# EasyEDA Pro project ProPrj_stm32星闪-2025-5_2025-05-30.epro

# Schematic Schematic1_1
Board Name: 板子B; Create Date: 2025-05-24; Page Name: P2; Project Name: stm32星闪-2025-5; Schematic Name: Schematic1_1; Update Date: 2025-05-24; Company: 嘉立创EDA; Page Size: A4; Version: V1.0
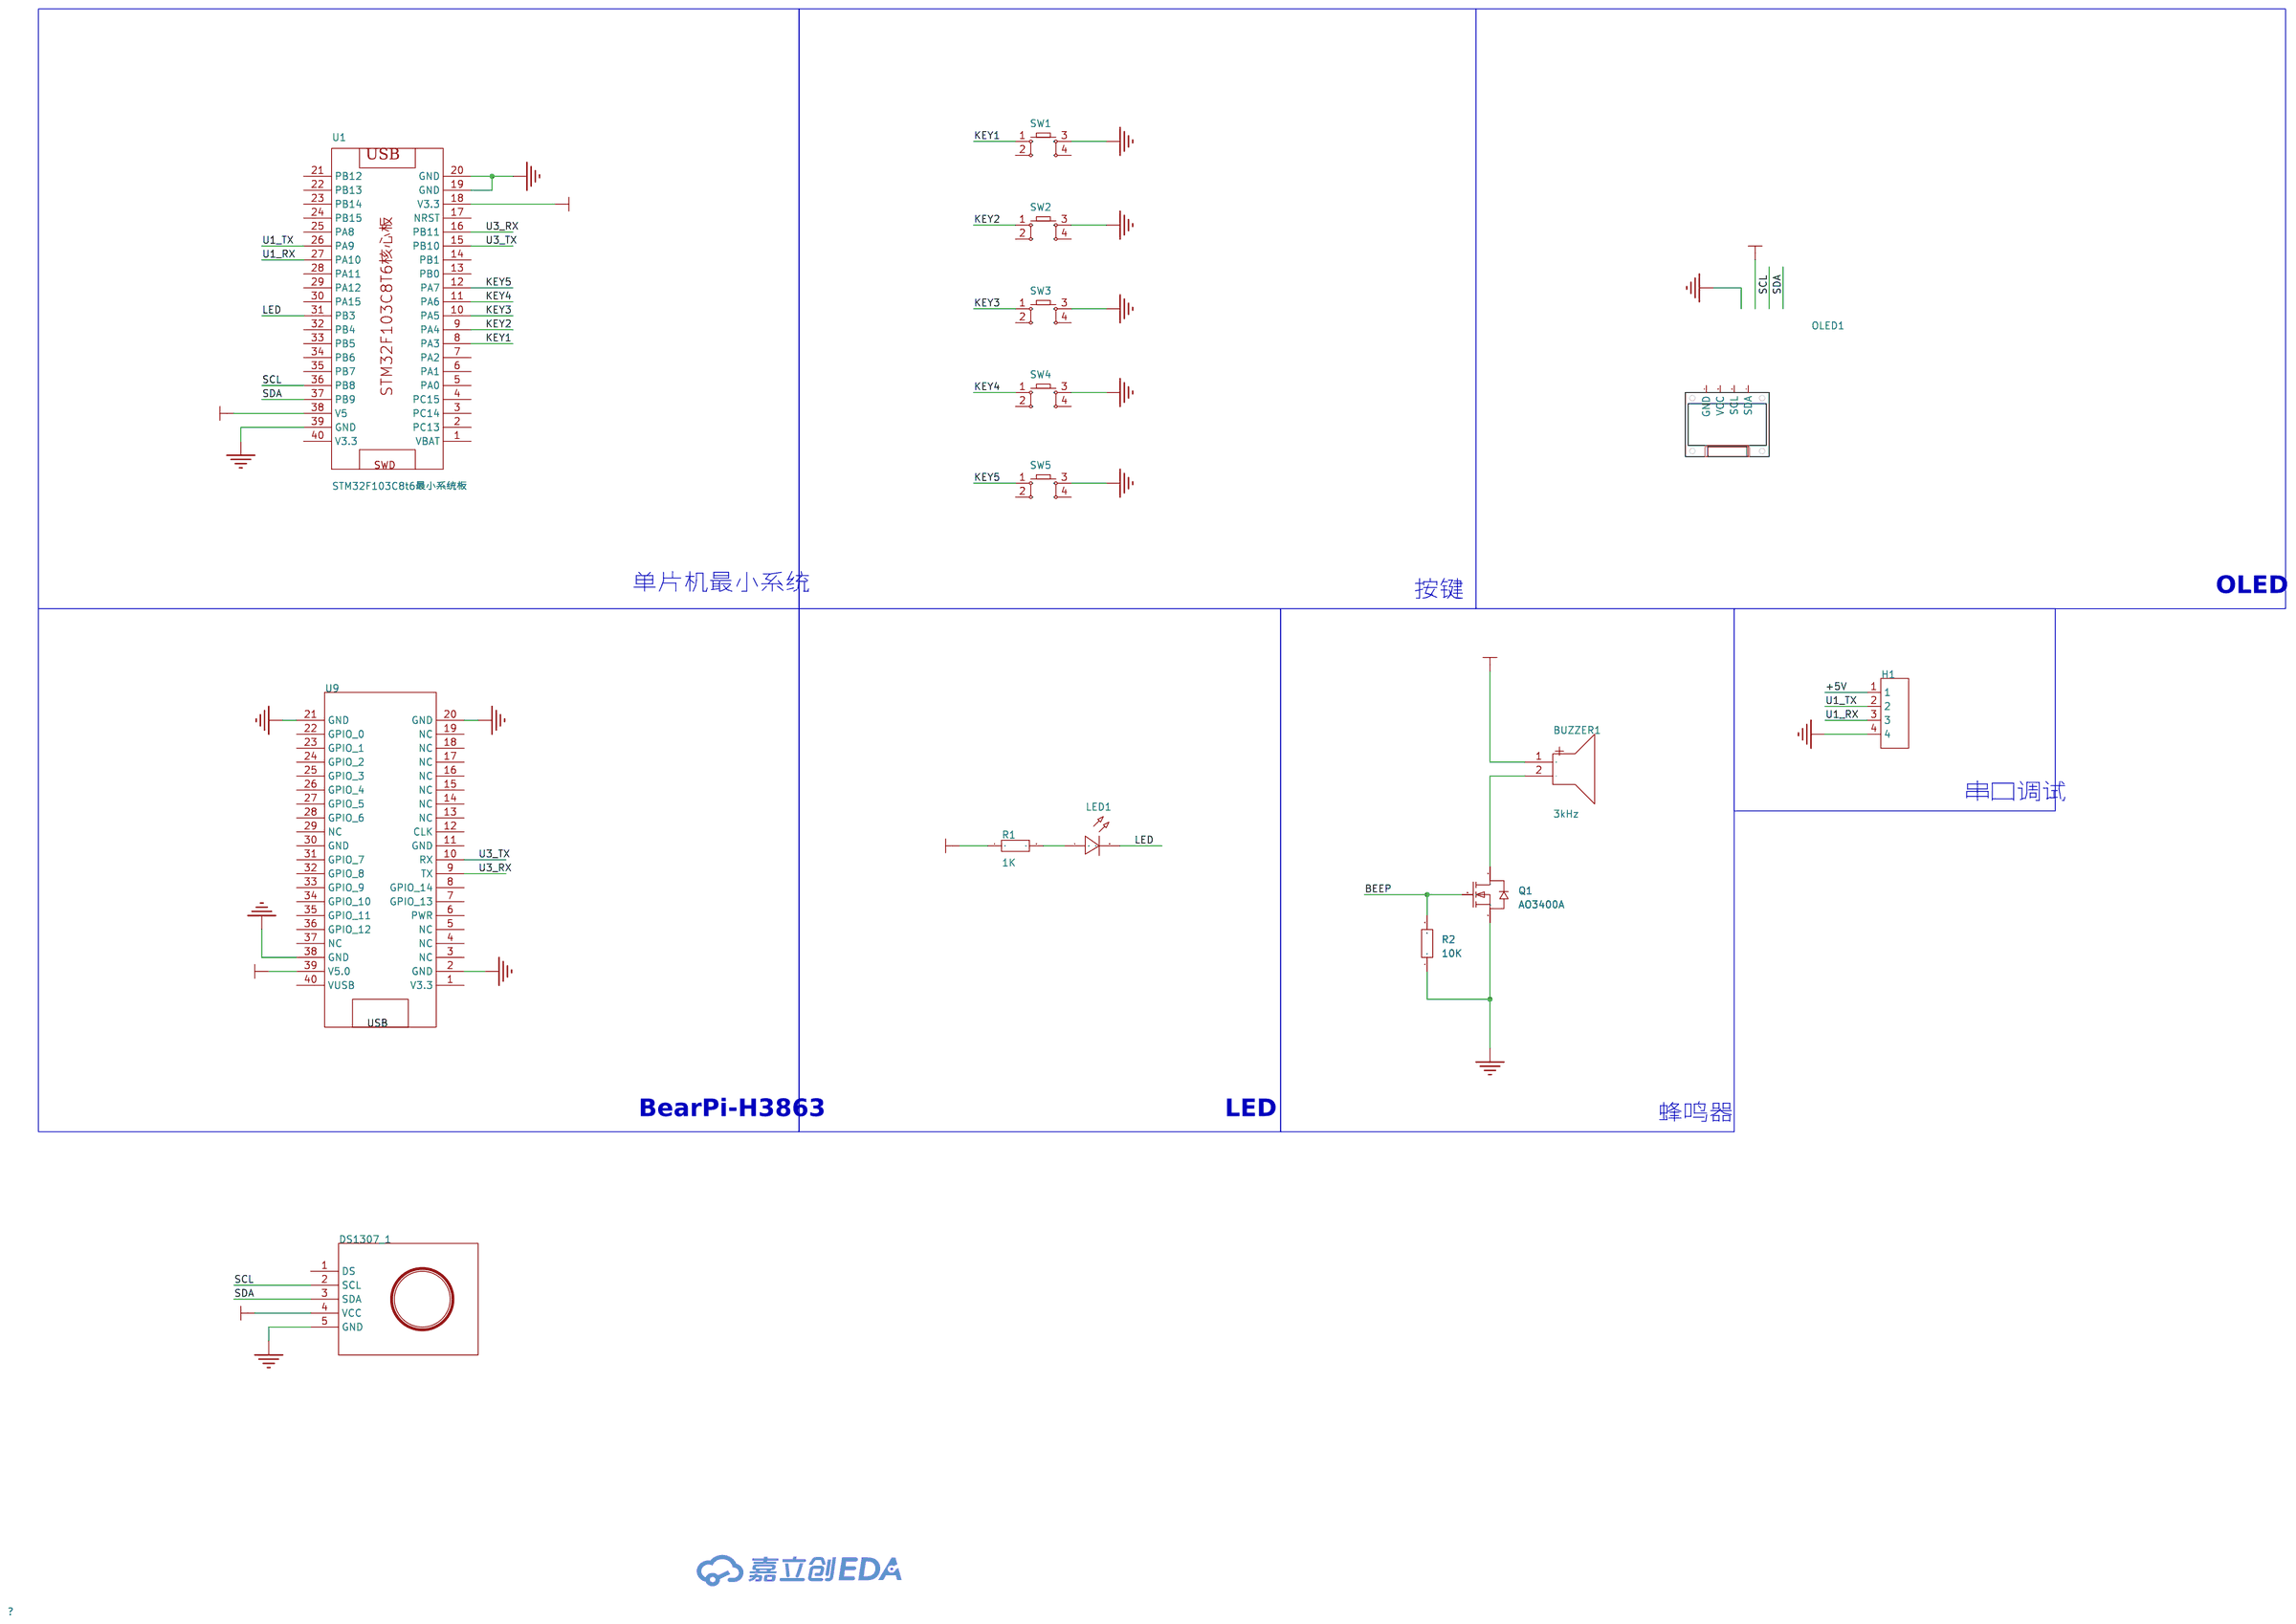
[diagram p0: schematic sheet]

## Parts
BUZZER1  3kHz  [BUZ-TH_BD9.0-P5.00-D0.6-FD]
DS1307_1  -  [DS1307时钟模块]
H1  -  [HDR-TH_4P-P2.54-V-M]
LED1  -  [LED_TH-3mm]
OLED1  -  [0.96OLED_4P]
Q1  AO3400A  [SOT-23-3_L2.9-W1.3-P1.90-LS2.4-BR]
R1  1K  [R0603]
R2  10K  [R0603]
SW1  -  [SW-TH_4P-L6.0-W6.0-P4.50-LS6.5]
SW2  -  [SW-TH_4P-L6.0-W6.0-P4.50-LS6.5]
SW3  -  [SW-TH_4P-L6.0-W6.0-P4.50-LS6.5]
SW4  -  [SW-TH_4P-L6.0-W6.0-P4.50-LS6.5]
SW5  -  [SW-TH_4P-L6.0-W6.0-P4.50-LS6.5]
U1  STM32F103C8t6最小系统板  [STM32F103C8T6核心板]
U9  -  [H3863]

## Library data of the parts
BUZZER1 = HNB09A03: 驱动方式:有源(内含驱动线路);构造类型:电磁式;频率:3kHz;声压(SPL):85dB;; LCSC Part Name: 电磁式有源一体蜂鸣器HNB09A03; Supplier Part: C96102; Manufacturer: 华能; Supplier Footprint: 插件,D=9mm; JLCPCB Part Class: 扩展库; Datasheet: https://atta.szlcsc.com/upload/public/pdf/source/20241128/61C4C8C3938BB25F7C38FBE94CCE8DCF.pdf; Supplier: LCSC; Driver Circuitry: 有源(内含驱动线路); Technology: 电磁式; Voltage - Supply: 1.5V~4.5V; Current Consumption: 30mA; Sound Pressure Level(SPL): 85dB; Diameter(φD): 9mm; Height: 5.5mm; Operating Temperature: -20℃~+70℃
DS1307_1 = DS1307_时钟模块_电池朝上: DS1307时钟模块.集成了个ATM_TC086,32KB的EEPROM
H1 = HDR-M_2.54_1x4P: Supplier Part: C492403; Supplier Footprint: 插件
LED1 = LED_TH-R_3mm: Supplier Footprint: 插件
OLED1 = 0.96OLED模块_4P: Supplier Footprint: 插件
Q1 = AO3400A_C347475: 类型:1个N沟道;漏源电压(Vdss):30V;连续漏极电流(Id):5.8A;导通电阻(RDS(on)@Vgs,Id):28mΩ@10V,5.8A;功率(Pd):1.4W;阈值电压(Vgs(th)@Id):1.4V@250uA;; LCSC Part Name: 1个N沟道 耐压:30V 电流:5.8A; Supplier Part: C347475; Manufacturer: UMW(友台半导体); Supplier Footprint: SOT-23; JLCPCB Part Class: 扩展库; Datasheet: https://atta.szlcsc.com/upload/public/pdf/source/20231109/50AB4FB4D66E55864F9B8D027B723C9A.pdf; Supplier: LCSC; Type: 1个N沟道; Drain Source Voltage (Vdss): 30V; Continuous Drain Current (Id): 5.8A; Drain Source On Resistance (RDS(on)@Vgs,Id): 28mΩ@10V,5.8A; Power Dissipation (Pd): 1.4W; Gate Threshold Voltage (Vgs(th)@Id): 1.4V@250uA; Total Gate Charge (Qg@Vgs): 12nC@10V; Input Capacitance (Ciss@Vds): 1.05nF@24V; Reverse Transfer Capacitance (Crss@Vds): 77pF@15V; Operating Temperature: -55℃~+150℃
R1 R2 = Res_0603: Supplier Footprint: 0603
SW1-SW5 = Key_TH_6x6x6: 触点电流:50mA;额定电压(DC):12V;绝缘电阻:100MΩ;电路结构:单刀单掷;安装方式:直插;按钮形状:圆形按钮;按钮/盖帽颜色:黑色;作用力:260gf@±30gf;工作温度:-25℃~+70℃;引脚样式:PC引脚;开关长度:6mm;开关宽度:6mm;开关高度:6mm;带支架:否;; Supplier Part: C2837516; Supplier Footprint: 插件
U1 = STM32F103C8T6最小系统板: tags: STM32; Supplier Part: C8734; Manufacturer: 无; Manufacturer Part: STM32F103C8T6最小系统模块; image: http://image.lceda.cn/szlcsc/C8734.jpg; JLCPCB Part Class: Basic Part
U9 = H3863: 小熊派H3863

## Nets
3V3: DS1307_1.4(VCC) R1.1 U1.18(V3.3)
+5V: BUZZER1.1(+) H1.1 U1.38(V5) U9.39(V5.0)
GND: DS1307_1.5(GND) H1.4 Q1.2(S) R2.1 SW1.3 SW2.3 SW3.3 SW4.3 SW5.3 U1.19(GND) U1.20(GND) U1.39(GND) U9.2(GND) U9.20(GND) U9.21(GND) U9.38(GND)
BEEP: Q1.1(G) R2.2
KEY1: SW1.1 U1.8(PA3)
KEY2: SW2.1 U1.9(PA4)
KEY3: SW3.1 U1.10(PA5)
KEY4: SW4.1 U1.11(PA6)
KEY5: SW5.1 U1.12(PA7)
LED: LED1.2(A) U1.31(PB3)
SCL: DS1307_1.2(SCL) U1.36(PB8)
SDA: DS1307_1.3(SDA) U1.37(PB9)
U1_RX: H1.3 U1.27(PA10)
U1_TX: H1.2 U1.26(PA9)
U3_RX: U1.16(PB11) U9.9(TX)
U3_TX: U1.15(PB10) U9.10(RX)
$2N4343: LED1.1(C) R1.2
$2N6086: BUZZER1.2(-) Q1.3(D)

Not connected (* = marked no-connect by the designer): DS1307_1 1(DS); OLED1 1(GND) 2(VCC) 3(SCL) 4(SDA); SW1 2 4; SW2 2 4; SW3 2 4; SW4 2 4; SW5 2 4; U1 1(VBAT) 2(PC13) 3(PC14) 4(PC15) 5(PA0) 6(PA1) 7(PA2) 13(PB0) 14(PB1) 17(NRST) 21(PB12) 22(PB13) 23(PB14) 24(PB15) 25(PA8) 28(PA11) 29(PA12) 30(PA15) 32(PB4) 33(PB5) 34(PB6) 35(PB7) 40(V3.3); U9 1(V3.3) 3(NC) 4(NC) 5(NC) 6(PWR) 7(GPIO_13) 8(GPIO_14) 11(GND) 12(CLK) 13(NC) 14(NC) 15(NC) 16(NC) 17(NC) 18(NC) 19(NC) 22(GPIO_0) 23(GPIO_1) 24(GPIO_2) 25(GPIO_3) 26(GPIO_4) 27(GPIO_5) 28(GPIO_6) 29(NC) 30(GND) 31(GPIO_7) 32(GPIO_8) 33(GPIO_9) 34(GPIO_10) 35(GPIO_11) 36(GPIO_12) 37(NC) 40(VUSB)

## Notes on the sheet
- 单片机最小系统
- 按键
- OLED
- 串口调试
- BearPi-H3863
- LED
- 蜂鸣器

# Schematic Schematic1
Board Name: 板子A; Create Date: 2025-05-24; Page Name: P2; Project Name: stm32星闪-2025-5; Schematic Name: Schematic1; Update Date: 2025-05-24; Company: 嘉立创EDA; Page Size: A4; Version: V1.0
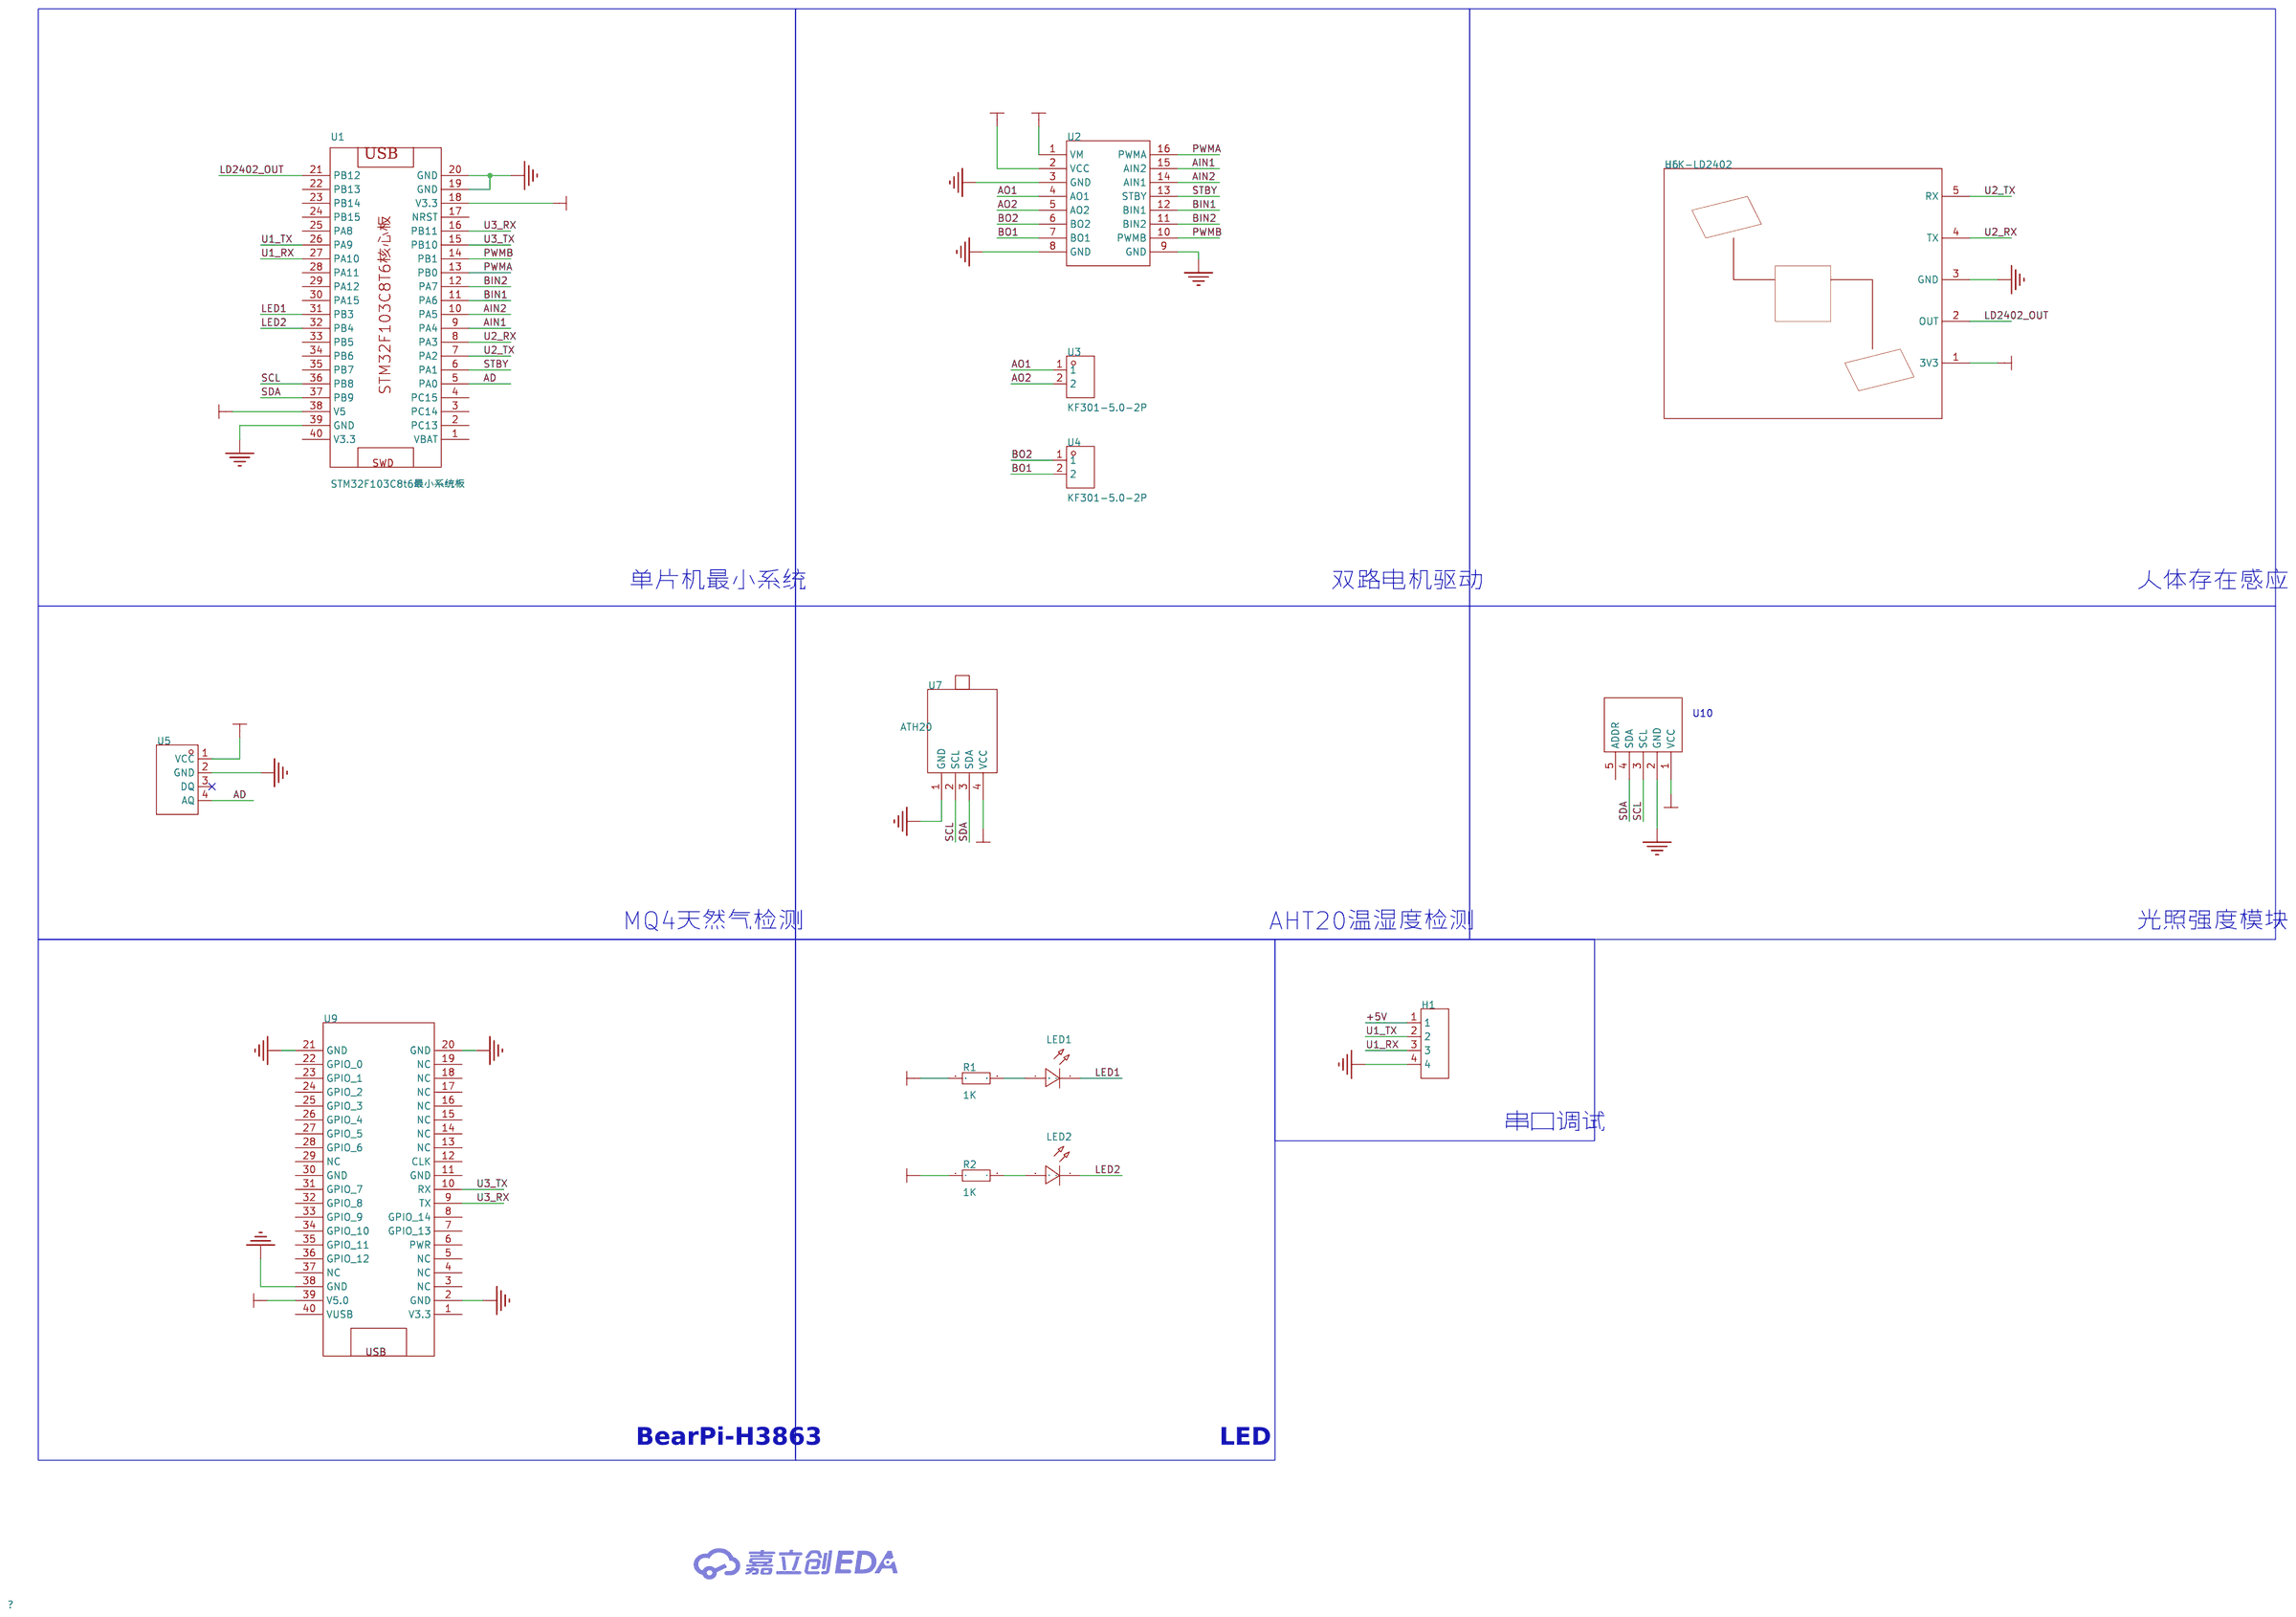
[diagram p1: schematic sheet]

## Parts
H1  -  [HDR-TH_4P-P2.54-V-M]
LED1  -  [LED_TH-3mm]
LED2  -  [LED_TH-3mm]
R1  1K  [R0603]
R2  1K  [R0603]
U1  STM32F103C8t6最小系统板  [STM32F103C8T6核心板]
U2  -  [TB6612]
U3  KF301-5.0-2P  [CONN-TH_P5.00_KF301-5.0-2P]
U4  KF301-5.0-2P  [CONN-TH_P5.00_KF301-5.0-2P]
U5  -  [MQ-4P]
U6  HLK-LD2402  [HLK-LD2402]
U7  ATH20  [ATH20]
U9  -  [H3863]
U10  -  [BH1750的封装]

## Library data of the parts
H1 = HDR-M_2.54_1x4P: Supplier Part: C492403; Supplier Footprint: 插件
LED1 = LED_TH-R_3mm: Supplier Footprint: 插件
LED2 = LED_TH-B_3mm: Supplier Footprint: 插件
R1 R2 = Res_0603: Supplier Footprint: 0603
U1 = STM32F103C8T6最小系统板: tags: STM32; Supplier Part: C8734; Manufacturer: 无; Manufacturer Part: STM32F103C8T6最小系统模块; image: http://image.lceda.cn/szlcsc/C8734.jpg; JLCPCB Part Class: Basic Part
U2 = TB6612
U3 U4 = KF301-5.0-2P: 结构:1x2P;间距:5mm;颜色:蓝色;安装方式:直插;额定电流:17A;额定电压:250V;排数:1;线规 - AWG:14~22;线规 - 平方毫米:1.5;每排PIN数:2;工作温度范围:-30℃~+120℃;; LCSC Part Name: 5mm 1x2P 排数:1 每排P数:2 直插; Supplier Part: C474881; Manufacturer: KEFA(科发); Supplier Footprint: 插件,P=5mm; JLCPCB Part Class: 扩展库; Datasheet: https://atta.szlcsc.com/upload/public/pdf/source/20230317/03A5B5FC229D6F9225E8F51DA1A4E80A.pdf; Supplier: LCSC; Structure: 1x2P; Pitch: 5mm; Color: 蓝色; Mounting Style: 直插; Current Rating (Max): 17A; Voltage Rating (Max): 250V; Number of Pins: 2P; Number of Rows: 1; Wire Gauge - AWG: 14~22; Wire Gauge - mm2: 1.5; Number of PINs Per Row: 2; Operating Temperature Range: -30℃~+120℃
U5 = MQ-4: _: 3
U6 = HLK-LD2402: 海凌科毫米波传感器芯片研发的静止人体生命存在传感器。不带蓝牙。
U7 = AHT20温湿度模块
U9 = H3863: 小熊派H3863
U10 = BH1750

## Nets
3V3: R1.1 R2.1 U1.18(V3.3) U2.2(VCC) U6.1(3V3) U10.1(VCC)
+5V: H1.1 U1.38(V5) U2.1(VM) U5.1(VCC) U7.4(VCC) U9.39(V5.0)
GND: H1.4 U1.19(GND) U1.20(GND) U1.39(GND) U2.3(GND) U2.8(GND) U2.9(GND) U5.2(GND) U6.3(GND) U7.1(GND) U9.2(GND) U9.20(GND) U9.21(GND) U9.38(GND) U10.2(GND)
AD: U1.5(PA0) U5.4(AQ)
AIN1: U1.9(PA4) U2.15(AIN2)
AIN2: U1.10(PA5) U2.14(AIN1)
AO1: U2.4(AO1) U3.1
AO2: U2.5(AO2) U3.2
BIN1: U1.11(PA6) U2.12(BIN1)
BIN2: U1.12(PA7) U2.11(BIN2)
BO1: U2.7(BO1) U4.2
BO2: U2.6(BO2) U4.1
LD2402_OUT: U1.21(PB12) U6.2(OUT)
LED1: LED1.2(A) U1.31(PB3)
LED2: LED2.2(A) U1.32(PB4)
PWMA: U1.13(PB0) U2.16(PWMA)
PWMB: U1.14(PB1) U2.10(PWMB)
SCL: U1.36(PB8) U7.2(SCL) U10.3(SCL)
SDA: U1.37(PB9) U7.3(SDA) U10.4(SDA)
STBY: U1.6(PA1) U2.13(STBY)
U1_RX: H1.3 U1.27(PA10)
U1_TX: H1.2 U1.26(PA9)
U2_RX: U1.8(PA3) U6.4(TX)
U2_TX: U1.7(PA2) U6.5(RX)
U3_RX: U1.16(PB11) U9.9(TX)
U3_TX: U1.15(PB10) U9.10(RX)
$2N4343: LED1.1(C) R1.2
$2N4348: LED2.1(C) R2.2

Not connected (* = marked no-connect by the designer): U1 1(VBAT) 2(PC13) 3(PC14) 4(PC15) 17(NRST) 22(PB13) 23(PB14) 24(PB15) 25(PA8) 28(PA11) 29(PA12) 30(PA15) 33(PB5) 34(PB6) 35(PB7) 40(V3.3); U5 3(DQ)*; U9 1(V3.3) 3(NC) 4(NC) 5(NC) 6(PWR) 7(GPIO_13) 8(GPIO_14) 11(GND) 12(CLK) 13(NC) 14(NC) 15(NC) 16(NC) 17(NC) 18(NC) 19(NC) 22(GPIO_0) 23(GPIO_1) 24(GPIO_2) 25(GPIO_3) 26(GPIO_4) 27(GPIO_5) 28(GPIO_6) 29(NC) 30(GND) 31(GPIO_7) 32(GPIO_8) 33(GPIO_9) 34(GPIO_10) 35(GPIO_11) 36(GPIO_12) 37(NC) 40(VUSB); U10 5(ADDR)

## Notes on the sheet
- 单片机最小系统
- 双路电机驱动
- 人体存在感应
- MQ4天然气检测
- AHT20温湿度检测
- 光照强度模块
- 串口调试
- BearPi-H3863
- LED

# Board PCB1_2
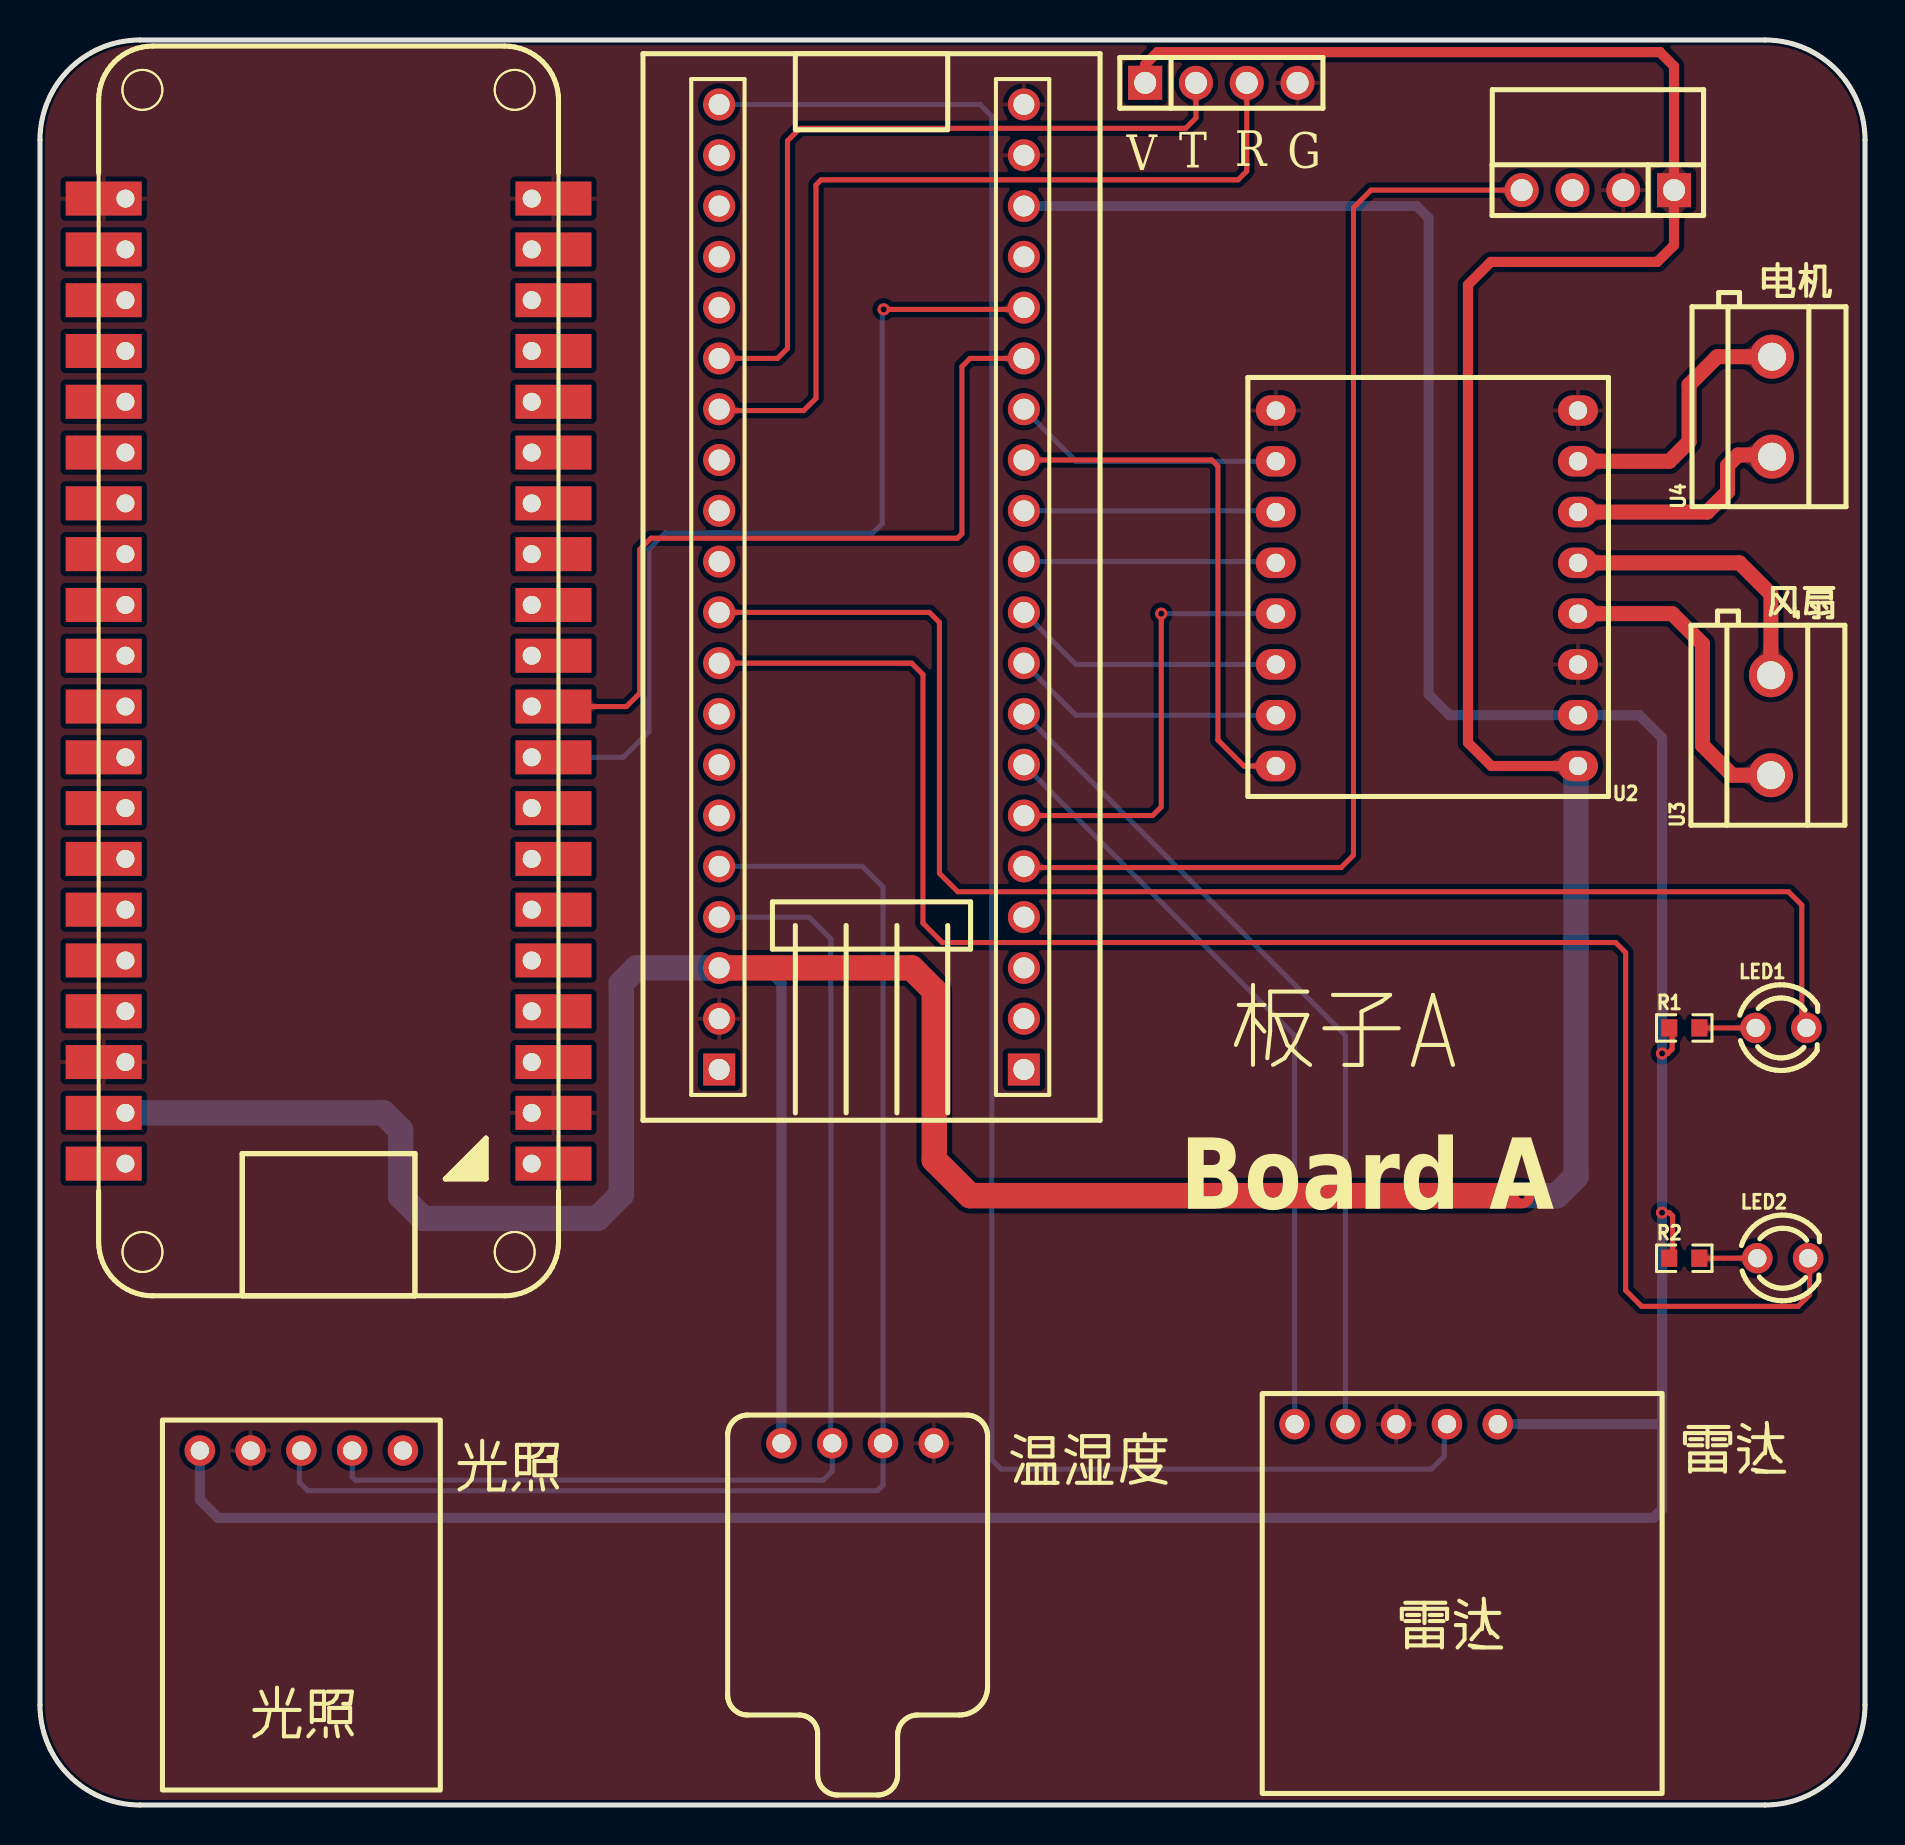
[diagram p2: board, top side]
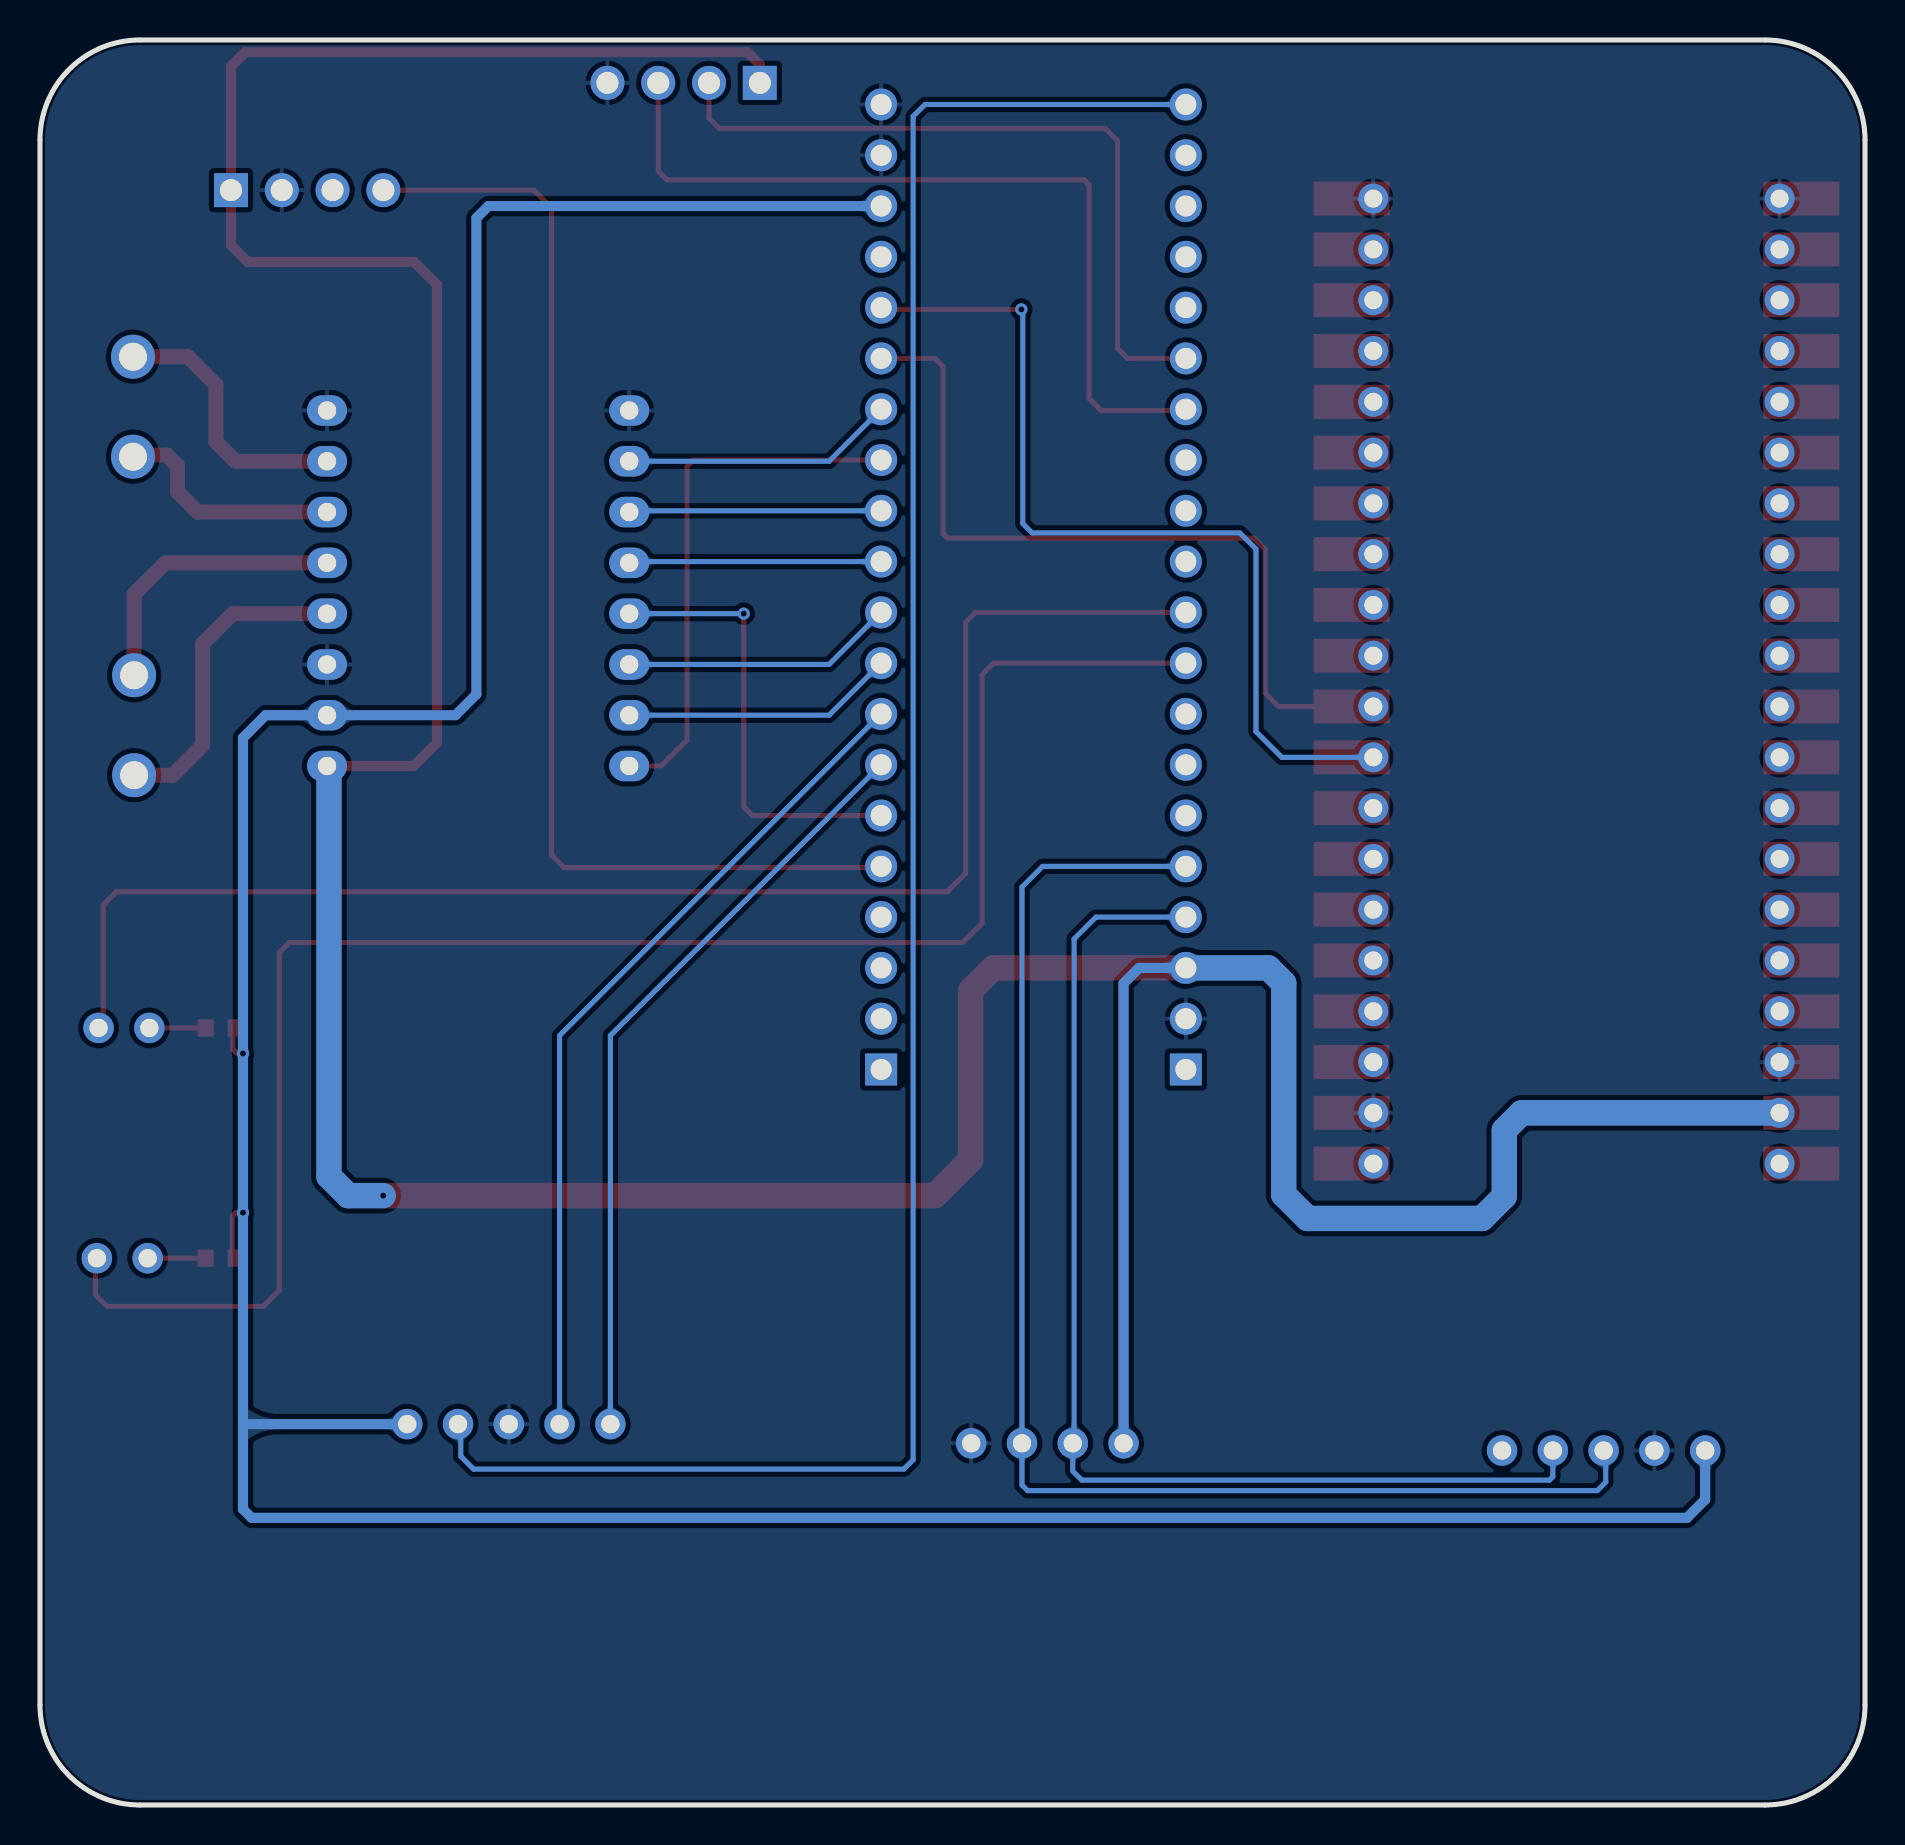
[diagram p3: board, bottom side, seen from below]

Outline 91.28 x 88.27 mm; copper layers: Top Layer, Bottom Layer. Coordinates in mm from the lower left corner of the outline.
Outline path: 0,83.27 0,5 arc(1.46,1.46) 5,0 86.28,0 arc(89.81,1.46) 91.28,5 91.28,83.27 arc(89.81,86.8) 86.28,88.27 5,88.27 arc(1.46,86.8) 0,83.27
Stack: Top Layer 0.035mm / Dielectric1 1.51mm FR4 er 4.5 / Bottom Layer 0.035mm

## Design rules (mm)
template: JLCPCB Capability(Two Layers Board)
spacing copperThickness1oz (default): track to track 0.102, other pairs 0.152 to 0.3
spacing copperThickness2oz: track to track 0.203, other pairs 0.152 to 0.3
track width copperThickness1oz (default): min 0.127, default 0.254, max 2.54
track width copperThickness2oz: min 0.203, default 0.254, max 2.54
differential pair differentialPair (default): width min 0.127, default 0.254, max 2.54; gap min 0.152, default 0.152
via viaSize (default): diameter min 0.5, default 0.61, max 10; hole min 0.3, default 0.305, max 6.3

## Placement (name value [footprint] x y rotation side)
H1  -  [HDR-TH_4P-P2.54-V-M]  59.09 86.12 0 top
LED1  -  [LED_TH-3mm]  87.08 38.86 0 top
LED2  -  [LED_TH-3mm]  87.16 27.34 0 top
R1  1K  [R0603]  82.24 38.86 0 top
R2  1K  [R0603]  82.24 27.34 0 top
U1  STM32F103C8t6最小系统板  [STM32F103C8T6核心板]  41.59 60.91 0 top
U2  -  [TB6612]  69.3 60.47 180 top
U3  KF301-5.0-2P  [CONN-TH_P5.00_KF301-5.0-2P]  86.57 54 90 top
U4  KF301-5.0-2P  [CONN-TH_P5.00_KF301-5.0-2P]  86.63 69.93 90 top
U5  -  [MQ-4P]  77.92 82.79 270 top
U6  -  [HLK-LD2402]  62.75 19.05 90 top
U7  -  [ATH20]  40.89 4.5 180 top
U9  -  [H3863]  14 59.2 0 top
U10  -  [BH1750的封装]  7.99 17.73 0 top

## Footprints (pads in the part's own frame, mm; a bottom-side part is the same pattern mirrored in y, then rotated)
ATH20
  round 1.524 hole 0.914: 1(-3.81,-13.589) 2(-1.27,-13.589) 3(1.27,-13.589) 4(3.81,-13.589)
BH1750的封装
  round 1.524 hole 0.914: 1(0,0) 2(2.54,0) 3(5.08,0) 4(7.62,0) 5(10.16,0)
CONN-TH_P5.00_KF301-5.0-2P
  round 2.2 hole 1.4: 1(-2.5,0) 2(2.5,0)
H3863
  round 1.5 hole 0.9: 1(10.592,-27.127) 2(10.592,-24.587) 3(10.592,-22.047) 4(10.592,-19.507) 5(10.592,-16.967) 6(10.592,-14.427) 7(10.592,-11.887) 8(10.592,-9.347) 9(10.592,-6.807) 10(10.592,-4.267) 11(10.592,-1.727) 12(10.592,0.813) 13(10.592,3.353) 14(10.592,5.893) 15(10.592,8.433) 16(10.592,10.973) 17(10.592,13.513) 18(10.592,16.053) 19(10.592,18.593) 20(10.592,21.133) 21(-9.728,21.133) 22(-9.728,18.593) 23(-9.728,16.053) 24(-9.728,13.513) 25(-9.728,10.973) 26(-9.728,8.433) 27(-9.728,5.893) 28(-9.728,3.353) 29(-9.728,0.813) 30(-9.728,-1.727) 31(-9.728,-4.267) 32(-9.728,-6.807) 33(-9.728,-9.347) 34(-9.728,-11.887) 35(-9.728,-14.427) 36(-9.728,-16.967) 37(-9.728,-19.507) 38(-9.728,-22.047) 39(-9.728,-24.587) 40(-9.728,-27.127)
  rect 3.8x1.7 smd: 1(11.678,-27.127) 2(11.678,-24.587) 3(11.678,-22.047) 4(11.678,-19.507) 5(11.678,-16.967) 6(11.678,-14.427) 7(11.678,-11.887) 8(11.678,-9.347) 9(11.678,-6.807) 10(11.678,-4.267) 11(11.678,-1.727) 12(11.678,0.813) 13(11.678,3.353) 14(11.678,5.893) 15(11.678,8.433) 16(11.678,10.973) 17(11.678,13.513) 18(11.678,16.053) 19(11.678,18.593) 20(11.678,21.133) 21(-10.814,21.133) 22(-10.814,18.593) 23(-10.814,16.053) 24(-10.814,13.513) 25(-10.814,10.973) 26(-10.814,8.433) 27(-10.814,5.893) 28(-10.814,3.353) 29(-10.814,0.813) 30(-10.814,-1.727) 31(-10.814,-4.267) 32(-10.814,-6.807) 33(-10.814,-9.347) 34(-10.814,-11.887) 35(-10.814,-14.427) 36(-10.814,-16.967) 37(-10.814,-19.507) 38(-10.814,-22.047) 39(-10.814,-24.587) 40(-10.814,-27.127)
HDR-TH_4P-P2.54-V-M
  rect 1.7x1.7 hole 1.1: 1(-3.81,0)
  round 1.7 hole 1.1: 2(-1.27,0) 3(1.27,0) 4(3.81,0)
HLK-LD2402
  round 1.524 hole 0.914: 1(0,-10.16) 2(0,-7.62) 3(0,-5.08) 4(0,-2.54) 5(0,0)
LED_TH-3mm
  round 1.524 hole 0.914: 1(-1.27,0) 2(1.27,0)
MQ-4P
  rect 1.7x1.7 hole 1.1: 1(2.032,3.81)
  round 1.7 hole 1.1: 2(2.032,1.27) 3(2.032,-1.27) 4(2.032,-3.81)
R0603
  rect 0.806x0.864 smd: 1(-0.753,0) 2(0.753,0)
STM32F103C8T6核心板
  rect 1.6x1.6 hole 1.049: 1(7.62,-24.13) 40(-7.62,-24.13)
  round 1.6 hole 1.049: 2(7.62,-21.59) 3(7.62,-19.05) 4(7.62,-16.51) 5(7.62,-13.97) 6(7.62,-11.43) 7(7.62,-8.89) 8(7.62,-6.35) 9(7.62,-3.81) 10(7.62,-1.27) 11(7.62,1.27) 12(7.62,3.81) 13(7.62,6.35) 14(7.62,8.89) 15(7.62,11.43) 16(7.62,13.97) 17(7.62,16.51) 18(7.62,19.05) 19(7.62,21.59) 20(7.62,24.13) 21(-7.62,24.13) 22(-7.62,21.59) 23(-7.62,19.05) 24(-7.62,16.51) 25(-7.62,13.97) 26(-7.62,11.43) 27(-7.62,8.89) 28(-7.62,6.35) 29(-7.62,3.81) 30(-7.62,1.27) 31(-7.62,-1.27) 32(-7.62,-3.81) 33(-7.62,-6.35) 34(-7.62,-8.89) 35(-7.62,-11.43) 36(-7.62,-13.97) 37(-7.62,-16.51) 38(-7.62,-19.05) 39(-7.62,-21.59)
TB6612
  oval 2x1.524 hole 0.914: 1(-7.62,8.509) 2(-7.62,5.969) 3(-7.62,3.429) 4(-7.62,0.889) 5(-7.62,-1.651) 6(-7.62,-4.191) 7(-7.62,-6.731) 8(-7.62,-9.271) 9(7.493,-9.271) 10(7.493,-6.731) 11(7.493,-4.191) 12(7.493,-1.651) 13(7.493,0.889) 14(7.493,3.429) 15(7.493,5.969) 16(7.493,8.509)

## Nets
As in the schematic.

Pads without a net: U1 1 2 3 4 17 22 23 24 25 28 29 30 33 34 35 40; U5 3; U9 1 3 4 5 6 7 8 11 12 13 14 15 16 17 18 19 22 23 24 25 26 27 28 29 30 31 32 33 34 35 36 37 40; U10 5

## Via types
v1: diameter 0.61, hole 0.305, Top Layer to Bottom Layer, 5 vias

## Routing (per net, layer and track width the routed paths; a pad name or vN(x,y) marks a point on that pad's centre or on a via; arc(x,y) is an arc through that point)
3V3: length 184.3
  Top Layer w0.254: 81.49,38.86 81.63,38.71 81.63,37.81 81.41,37.58 v1(81.13,37.58) ; 81.49,27.34 81.66,27.52 81.66,29.46 81.49,29.62 v1(81.13,29.62)
  Bottom Layer w0.5: U2.2 70.5,54.5 69.45,55.55 69.45,79.36 68.85,79.96 U1.18
  Bottom Layer w0.508: U2.2 79.99,54.5 81.13,53.37 v1(81.13,37.58) v1(81.13,29.62) 81.13,19.05 ; 81.13,19.05 81.13,14.79 80.69,14.36 8.91,14.36 7.99,15.27 U10.1 ; 81.13,19.05 U6.1
+5V: length 222
  Top Layer w0.508: U2.1 72.59,51.96 71.42,53.13 71.42,76.02 72.56,77.17 80.89,77.17 81.73,78 U5.1 81.73,86.95 81.02,87.66 55.89,87.66 55.28,87.04 H1.1
  Top Layer w1.27: v1(74.11,30.47) 46.52,30.47 44.73,32.26 44.73,40.73 43.59,41.86 U1.38
  Bottom Layer w0.508: U7.4 37.08,41.09 36.31,41.86 U1.38
  Bottom Layer w1.27: U2.1 76.83,51.86 76.83,31.44 75.86,30.47 v1(74.11,30.47) ; U9.39 17.18,34.61 18.04,33.75 18.04,30.45 19.15,29.33 27.88,29.33 29.07,30.52 29.07,41.1 29.84,41.86 U1.38
AD: length 57.9
  Top Layer w0.254: U5.4 66.57,80.76 65.69,79.88 65.69,47.5 65.07,46.88 49.27,46.88 U1.5
AIN1: length 13.7
  Bottom Layer w0.254: U1.9 51.81,54.5 61.81,54.5
AIN2: length 13.7
  Bottom Layer w0.254: U1.10 51.81,57.04 61.81,57.04
AO1: length 16
  Top Layer w0.75: U3.1 84.64,51.5 83.15,52.99 83.15,58.06 81.63,59.58 U2.4
AO2: length 14.4
  Top Layer w0.75: U2.5 85,62.12 86.57,60.55 U3.2
BIN1: length 12.6
  Bottom Layer w0.254: U1.11 61.74,62.18 61.81,62.12
BIN2: length 12.6
  Bottom Layer w0.254: 61.81,64.66 61.74,64.72 U1.12
BO1: length 13.5
  Top Layer w0.75: U2.7 81.5,67.2 82.48,68.18 82.48,71.02 83.88,72.43 U4.2
BO2: length 11.7
  Top Layer w0.75: U4.1 86.54,67.51 84.93,67.51 84.4,66.98 84.4,65.67 83.39,64.66 U2.6
LD2402_OUT: length 105.8
  Bottom Layer w0.254: U1.21 47.01,85.04 47.61,84.45 47.61,17.26 48.07,16.8 69.59,16.8 70.23,17.44 70.23,18.91 U6.2
LED1: length 73.8
  Top Layer w0.254: LED1.2 88.12,39.09 88.12,45.01 87.45,45.67 45.9,45.67 44.99,46.59 44.99,59.14 44.48,59.64 U1.31
LED2: length 87.1
  Top Layer w0.254: U1.32 43.59,57.1 44.16,56.53 44.16,44.1 45.13,43.13 78.8,43.13 79.31,42.63 79.31,25.74 80.11,24.94 87.93,24.94 88.51,25.51 88.51,27.27 LED2.2
PWMA: length 27
  Top Layer w0.254: U1.13 58.6,67.26 58.91,66.95 58.91,53.25 60.21,51.96 61.81,51.96
PWMB: length 13.7
  Bottom Layer w0.254: 61.81,67.2 51.81,67.2 U1.14
SCL: length 69.6
  Bottom Layer w0.254: U10.3 12.97,17.62 12.97,16.15 13.4,15.72 41.88,15.72 42.16,16 U7.2 42.16,45.91 41.13,46.94 U1.36
SDA: length 58.6
  Bottom Layer w0.254: 39.62,17.71 39.62,16.7 39.17,16.25 15.79,16.25 15.61,16.42 U10.4 ; 39.62,17.71 U7.3 ; 39.62,17.71 39.56,17.78 39.56,43.31 38.47,44.4 U1.37
STBY: length 22.4
  Top Layer w0.254: v1(56.08,59.58) 56.08,49.91 55.65,49.48 U1.6
  Bottom Layer w0.254: v1(56.08,59.58) 61.81,59.58
U1_RX: length 42
  Top Layer w0.254: H1.3 60.36,81.71 59.92,81.27 39.06,81.27 38.81,81.02 38.81,70.35 38.2,69.73 34.04,69.73 U1.27
U1_TX: length 36.7
  Top Layer w0.254: U1.26 36.89,72.34 37.39,72.84 37.39,83.23 38.01,83.85 57.3,83.85 57.82,84.36 H1.2
U2_RX: length 42.2
  Bottom Layer w0.254: U6.4 65.29,38.48 U1.8
U2_TX: length 38.6
  Bottom Layer w0.254: U1.7 62.75,38.48 U6.5
U3_RX: length 46.7
  Top Layer w0.254: v1(42.19,74.79) 49.12,74.79 U1.16 ; U9.9 25.54,52.53 24.73,52.53 U9.9
  Bottom Layer w0.254: U9.9 29.17,52.39 30.46,53.68 30.46,62.81 31.27,63.62 41.66,63.62 42.12,64.08 42.12,74.72 v1(42.19,74.79)
U3_TX: length 40.9
  Top Layer w0.254: U1.15 46.52,72.34 46.11,71.94 46.11,63.57 45.89,63.35 30.56,63.35 30,62.79 30,55.6 29.33,54.93 U9.10 U9.10
$2N4343: length 2.8
  Top Layer w0.254: LED1.1 R1.2
$2N4348: length 2.9
  Top Layer w0.254: LED2.1 R2.2

## Copper pours and planes (outline as drawn; the poured copper is in the pictures)
GND on Top Layer: -3.47,91.73 93.76,91.73 93.76,-3.09 -3.47,-3.09
GND on Bottom Layer: -2.2,92.72 96.72,92.72 96.72,-2.81 -2.2,-2.81

Small or netless copper shapes (teardrops, artwork), in the pictures only: 39 on Top Layer, 42 on Bottom Layer

## Text on the board
Top Silkscreen Layer: Board A | V | T | R | G | 电机 | 风扇 | 光照 | 雷达 | 温湿度 | 板子A

# Board PCB1
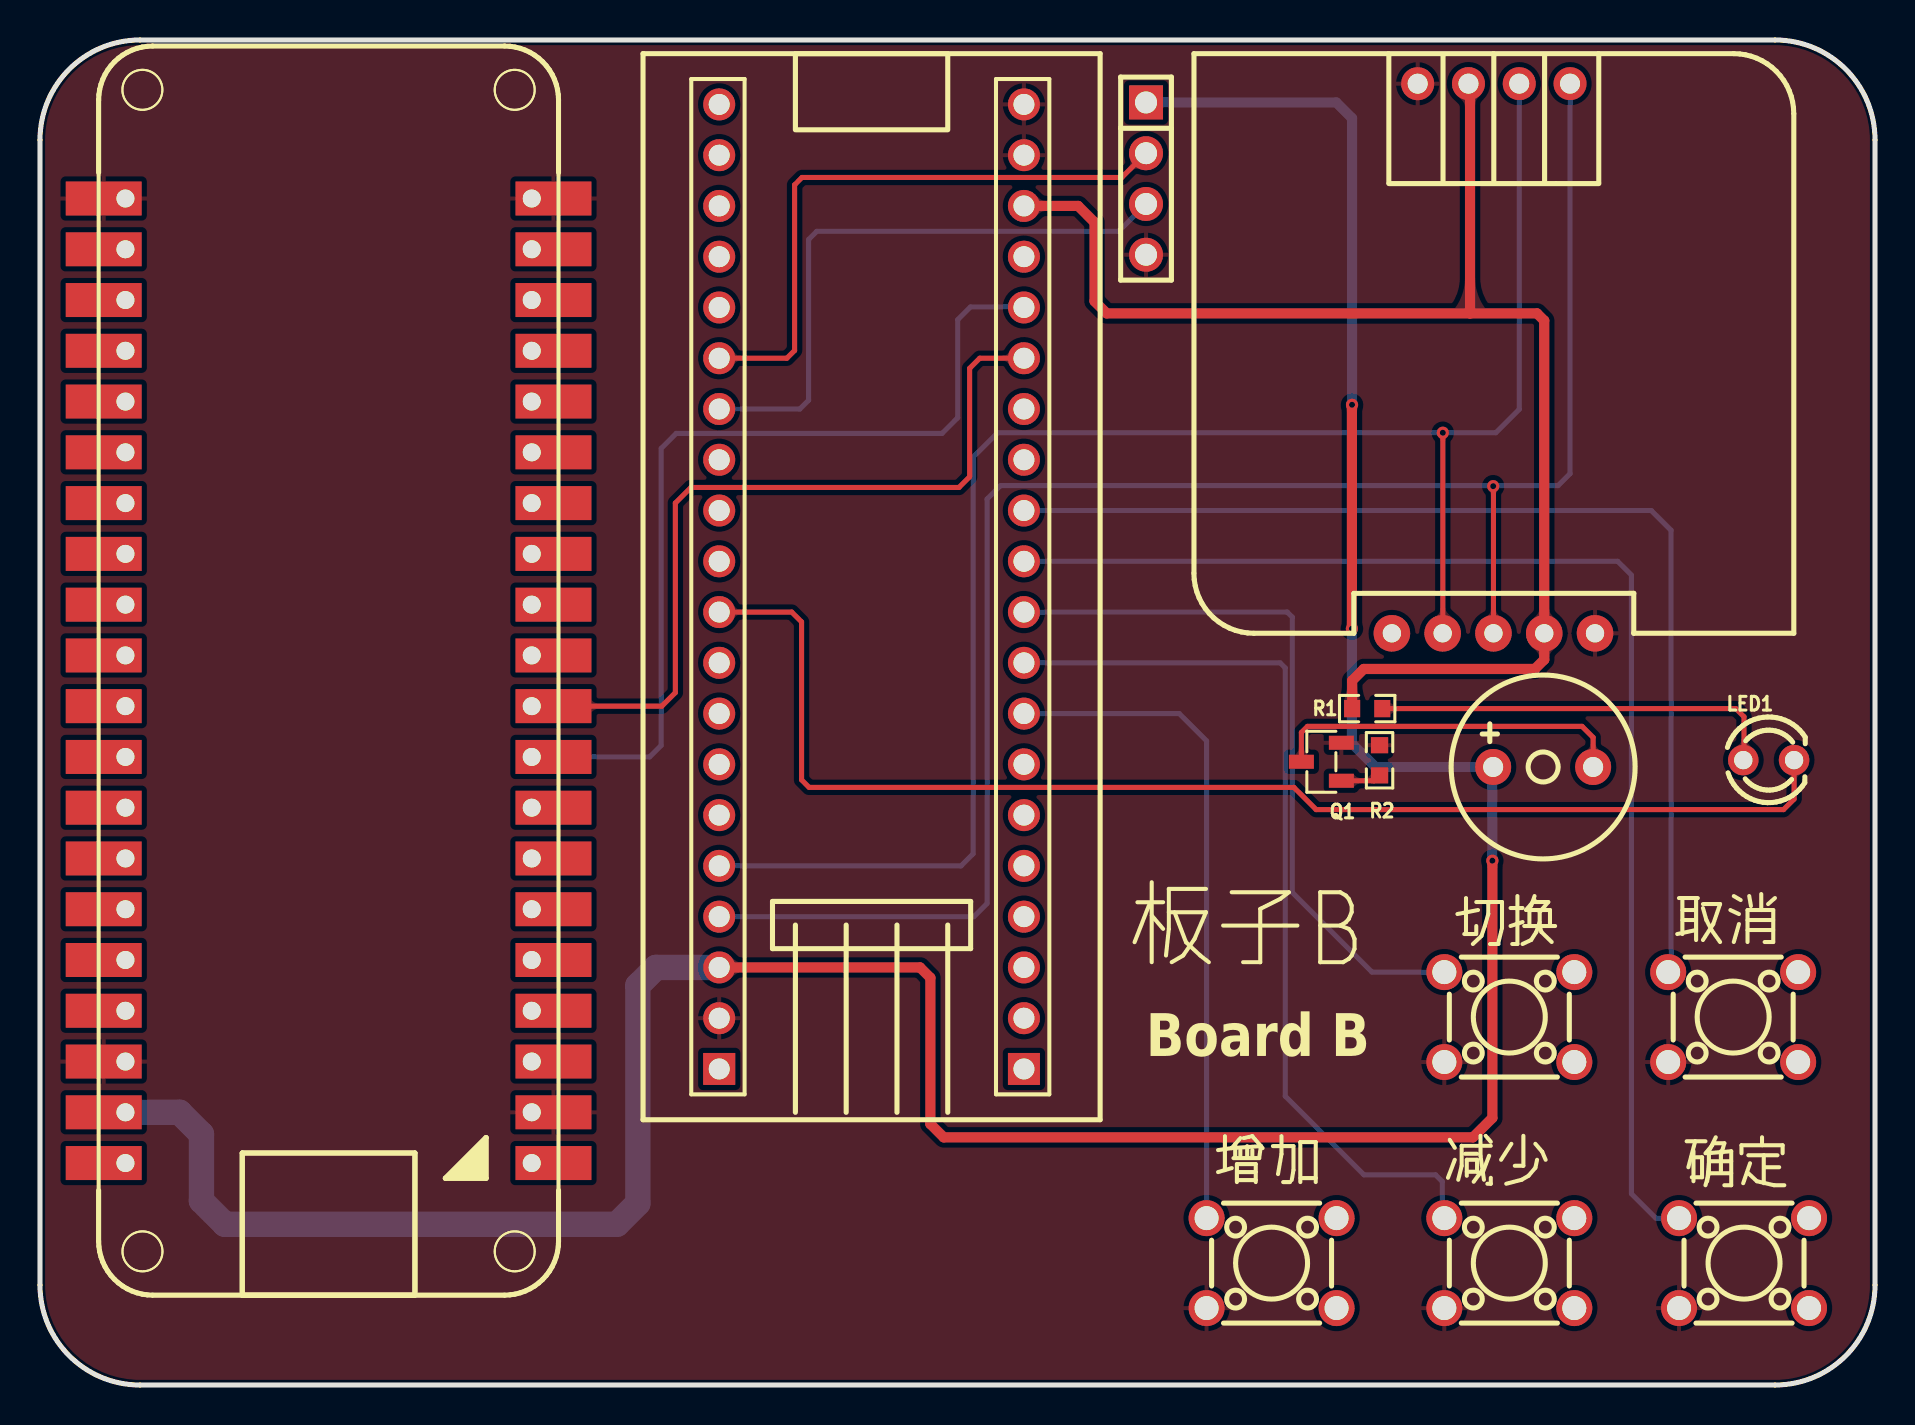
[diagram p4: board, top side]
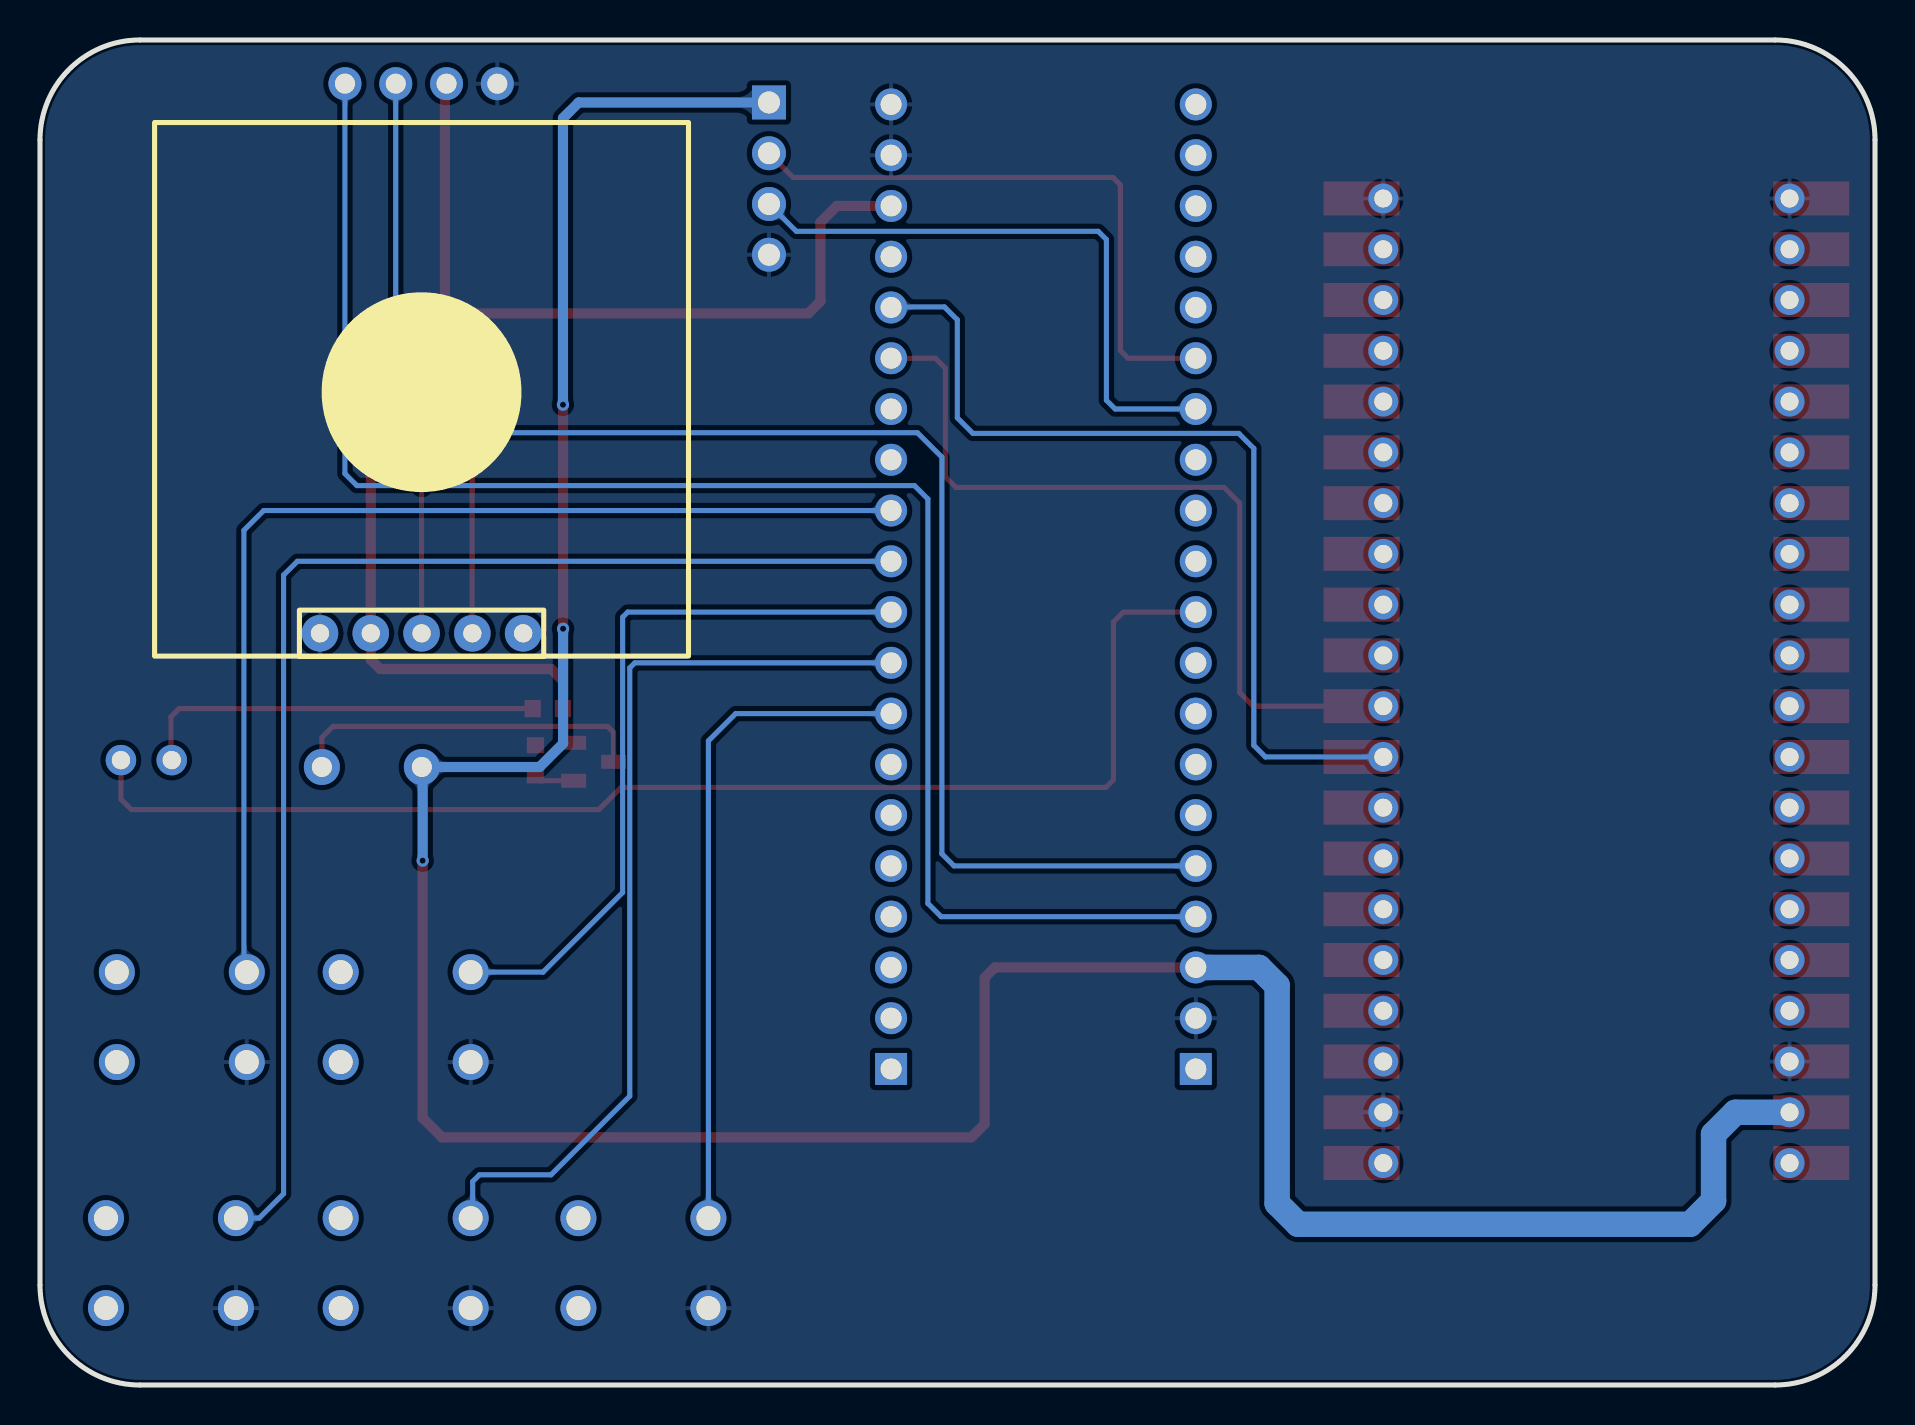
[diagram p5: board, bottom side, seen from below]

Outline 91.77 x 67.3 mm; copper layers: Top Layer, Bottom Layer. Coordinates in mm from the lower left corner of the outline.
Outline path: 0,62.3 0,5 arc(1.46,1.46) 5,0 86.77,0 arc(90.31,1.46) 91.77,5 91.77,62.3 arc(90.31,65.83) 86.77,67.3 5,67.3 arc(1.46,65.83) 0,62.3
Stack: Top Layer 0.035mm / Dielectric1 1.51mm FR4 er 4.5 / Bottom Layer 0.035mm

## Design rules (mm)
template: JLCPCB Capability(Two Layers Board)
spacing copperThickness1oz (default): track to track 0.102, other pairs 0.152 to 0.3
spacing copperThickness2oz: track to track 0.203, other pairs 0.152 to 0.3
track width copperThickness1oz (default): min 0.127, default 0.254, max 2.54
track width copperThickness2oz: min 0.203, default 0.254, max 2.54
differential pair differentialPair (default): width min 0.127, default 0.254, max 2.54; gap min 0.152, default 0.152
via viaSize (default): diameter min 0.5, default 0.61, max 10; hole min 0.3, default 0.305, max 6.3

## Placement (name value [footprint] x y rotation side)
BUZZER1  3kHz  [BUZ-TH_BD9.0-P5.00-D0.6-FD]  75.18 30.92 0 top
DS1307_1  -  [DS1307时钟模块]  72.69 62.01 270 bottom
H1  -  [HDR-TH_4P-P2.54-V-M]  55.31 60.36 270 top
LED1  -  [LED_TH-3mm]  86.46 31.27 0 top
OLED1  -  [0.96OLED_4P]  72.71 65.11 0 top
Q1  AO3400A  [SOT-23-3_L2.9-W1.3-P1.90-LS2.4-BR]  64.08 31.19 0 top
R1  1K  [R0603]  66.38 33.84 0 top
R2  10K  [R0603]  66.99 31.26 270 top
SW1  -  [SW-TH_4P-L6.0-W6.0-P4.50-LS6.5]  61.59 6.1 0 top
SW2  -  [SW-TH_4P-L6.0-W6.0-P4.50-LS6.5]  73.48 6.1 0 top
SW3  -  [SW-TH_4P-L6.0-W6.0-P4.50-LS6.5]  73.48 18.41 0 top
SW4  -  [SW-TH_4P-L6.0-W6.0-P4.50-LS6.5]  85.22 6.1 0 top
SW5  -  [SW-TH_4P-L6.0-W6.0-P4.50-LS6.5]  84.68 18.41 0 top
U1  STM32F103C8t6最小系统板  [STM32F103C8T6核心板]  41.59 39.94 0 top
U9  -  [H3863]  14 38.23 0 top

## Footprints (pads in the part's own frame, mm; a bottom-side part is the same pattern mirrored in y, then rotated)
0.96OLED_4P
  round 1.65 hole 1: 1(-3.81,-0.002) 2(-1.27,0.002) 3(1.27,0.002) 4(3.81,0.002)
BUZ-TH_BD9.0-P5.00-D0.6-FD
  round 1.8 hole 1: 1(-2.5,0) 2(2.5,0)
DS1307时钟模块
  round 1.828 hole 0.914: 1(24.399,5.08) 2(24.399,2.54) 3(24.399,0) 4(24.399,-2.54) 5(24.399,-5.08)
H3863
  round 1.5 hole 0.9: 1(10.592,-27.127) 2(10.592,-24.587) 3(10.592,-22.047) 4(10.592,-19.507) 5(10.592,-16.967) 6(10.592,-14.427) 7(10.592,-11.887) 8(10.592,-9.347) 9(10.592,-6.807) 10(10.592,-4.267) 11(10.592,-1.727) 12(10.592,0.813) 13(10.592,3.353) 14(10.592,5.893) 15(10.592,8.433) 16(10.592,10.973) 17(10.592,13.513) 18(10.592,16.053) 19(10.592,18.593) 20(10.592,21.133) 21(-9.728,21.133) 22(-9.728,18.593) 23(-9.728,16.053) 24(-9.728,13.513) 25(-9.728,10.973) 26(-9.728,8.433) 27(-9.728,5.893) 28(-9.728,3.353) 29(-9.728,0.813) 30(-9.728,-1.727) 31(-9.728,-4.267) 32(-9.728,-6.807) 33(-9.728,-9.347) 34(-9.728,-11.887) 35(-9.728,-14.427) 36(-9.728,-16.967) 37(-9.728,-19.507) 38(-9.728,-22.047) 39(-9.728,-24.587) 40(-9.728,-27.127)
  rect 3.8x1.7 smd: 1(11.678,-27.127) 2(11.678,-24.587) 3(11.678,-22.047) 4(11.678,-19.507) 5(11.678,-16.967) 6(11.678,-14.427) 7(11.678,-11.887) 8(11.678,-9.347) 9(11.678,-6.807) 10(11.678,-4.267) 11(11.678,-1.727) 12(11.678,0.813) 13(11.678,3.353) 14(11.678,5.893) 15(11.678,8.433) 16(11.678,10.973) 17(11.678,13.513) 18(11.678,16.053) 19(11.678,18.593) 20(11.678,21.133) 21(-10.814,21.133) 22(-10.814,18.593) 23(-10.814,16.053) 24(-10.814,13.513) 25(-10.814,10.973) 26(-10.814,8.433) 27(-10.814,5.893) 28(-10.814,3.353) 29(-10.814,0.813) 30(-10.814,-1.727) 31(-10.814,-4.267) 32(-10.814,-6.807) 33(-10.814,-9.347) 34(-10.814,-11.887) 35(-10.814,-14.427) 36(-10.814,-16.967) 37(-10.814,-19.507) 38(-10.814,-22.047) 39(-10.814,-24.587) 40(-10.814,-27.127)
HDR-TH_4P-P2.54-V-M
  rect 1.7x1.7 hole 1.1: 1(-3.81,0)
  round 1.7 hole 1.1: 2(-1.27,0) 3(1.27,0) 4(3.81,0)
LED_TH-3mm
  round 1.524 hole 0.914: 1(-1.27,0) 2(1.27,0)
R0603
  rect 0.806x0.864 smd: 1(-0.753,0) 2(0.753,0)
SOT-23-3_L2.9-W1.3-P1.90-LS2.4-BR
  rect 1.25x0.7 smd: 1(1,-0.95) 2(1,0.95) 3(-1,0)
STM32F103C8T6核心板
  rect 1.6x1.6 hole 1.049: 1(7.62,-24.13) 40(-7.62,-24.13)
  round 1.6 hole 1.049: 2(7.62,-21.59) 3(7.62,-19.05) 4(7.62,-16.51) 5(7.62,-13.97) 6(7.62,-11.43) 7(7.62,-8.89) 8(7.62,-6.35) 9(7.62,-3.81) 10(7.62,-1.27) 11(7.62,1.27) 12(7.62,3.81) 13(7.62,6.35) 14(7.62,8.89) 15(7.62,11.43) 16(7.62,13.97) 17(7.62,16.51) 18(7.62,19.05) 19(7.62,21.59) 20(7.62,24.13) 21(-7.62,24.13) 22(-7.62,21.59) 23(-7.62,19.05) 24(-7.62,16.51) 25(-7.62,13.97) 26(-7.62,11.43) 27(-7.62,8.89) 28(-7.62,6.35) 29(-7.62,3.81) 30(-7.62,1.27) 31(-7.62,-1.27) 32(-7.62,-3.81) 33(-7.62,-6.35) 34(-7.62,-8.89) 35(-7.62,-11.43) 36(-7.62,-13.97) 37(-7.62,-16.51) 38(-7.62,-19.05) 39(-7.62,-21.59)
SW-TH_4P-L6.0-W6.0-P4.50-LS6.5
  round 1.8 hole 1.2: 1(-3.25,2.25) 2(3.25,2.25) 3(-3.25,-2.25) 4(3.25,-2.25)

## Nets
3V3: DS1307_1.4 OLED1.2 R1.1 U1.18
+5V: BUZZER1.1 H1.1 U1.38 U9.39
GND: DS1307_1.5 H1.4 OLED1.1 Q1.2 R2.1 SW1.3 SW2.3 SW3.3 SW4.3 SW5.3 U1.19 U1.20 U1.39 U9.2 U9.20 U9.21 U9.38
BEEP: Q1.1 R2.2
KEY1: SW1.1 U1.8
KEY2: SW2.1 U1.9
KEY3: SW3.1 U1.10
KEY4: SW4.1 U1.11
KEY5: SW5.1 U1.12
LED: LED1.2 U1.31
SCL: DS1307_1.2 OLED1.3 U1.36
SDA: DS1307_1.3 OLED1.4 U1.37
U1_RX: H1.3 U1.27
U1_TX: H1.2 U1.26
U3_RX: U1.16 U9.9
U3_TX: U1.15 U9.10
$2N4343: LED1.1 R1.2
$2N6086: BUZZER1.2 Q1.3

Pads without a net: DS1307_1 1; SW1 2 4; SW2 2 4; SW3 2 4; SW4 2 4; SW5 2 4; U1 1 2 3 4 5 6 7 13 14 17 21 22 23 24 25 28 29 30 32 33 34 35 40; U9 1 3 4 5 6 7 8 11 12 13 14 15 16 17 18 19 22 23 24 25 26 27 28 29 30 31 32 33 34 35 36 37 40

## Via types
v1: diameter 0.61, hole 0.305, Top Layer to Bottom Layer, 5 vias

## Routing (per net, layer and track width the routed paths; a pad name or vN(x,y) marks a point on that pad's centre or on a via; arc(x,y) is an arc through that point)
3V3: length 70.6
  Top Layer w0.508: 71.52,53.62 71.52,65.03 OLED1.2 ; 71.52,53.62 74.87,53.62 75.23,53.26 DS1307_1.4 75.23,36.29 74.76,35.83 66.2,35.83 65.62,35.25 R1.1 ; 71.52,53.62 53.35,53.62 52.74,54.22 52.74,58.17 51.92,58.99 U1.18
+5V: length 159.6
  Top Layer w0.508: v1(72.64,26.24) 72.64,13.36 71.66,12.39 45.2,12.39 44.53,13.06 44.53,20.38 44.01,20.89 U1.38 ; v1(65.61,37.84) 65.61,49.04 v1(65.62,49.05)
  Bottom Layer w0.508: H1.1 64.83,64.17 65.62,63.38 v1(65.62,49.05) ; v1(72.64,26.24) 72.64,30.88 BUZZER1.1 66.78,30.92 65.61,32.1 v1(65.61,37.84)
  Bottom Layer w1.27: U1.38 30.81,20.89 29.9,19.99 29.9,9.09 28.85,8.04 9.25,8.04 8.07,9.21 8.07,12.55 6.98,13.65 U9.39
BEEP: length 2
  Top Layer w0.254: Q1.1 66.72,30.23 66.99,30.5
KEY1: length 33.6
  Bottom Layer w0.254: SW1.1 58.34,32.23 56.98,33.59 U1.8
KEY2: length 46.1
  Bottom Layer w0.254: U1.9 62.02,36.13 62.28,35.88 62.28,14.46 66.21,10.52 69.8,10.52 70.13,10.18 70.13,8.45 SW2.1
KEY3: length 36.6
  Bottom Layer w0.254: SW3.1 66.62,20.66 62.63,24.64 62.63,38.42 62.38,38.67 U1.10
KEY4: length 64.5
  Bottom Layer w0.254: SW4.1 80.81,8.35 79.59,9.57 79.59,40.52 78.9,41.21 U1.11
KEY5: length 54.9
  Bottom Layer w0.254: SW5.1 81.57,20.8 81.57,42.76 80.58,43.75 U1.12
LED: length 64.6
  Top Layer w0.254: U1.31 37.6,38.67 38.09,38.18 38.09,30.28 38.46,29.9 62.71,29.9 63.82,28.79 87.2,28.79 87.72,29.32 LED1.2
SCL: length 87.4
  Top Layer w0.254: v1(70.16,47.65) 70.16,37.62 DS1307_1.2
  Bottom Layer w0.254: U1.36 46.06,25.97 46.67,26.58 46.67,46.43 47.89,47.65 v1(70.16,47.65) 72.81,47.65 73.98,48.82 OLED1.3
SDA: length 90.5
  Top Layer w0.254: DS1307_1.3 72.69,44.96 v1(72.68,44.97)
  Bottom Layer w0.254: OLED1.4 76.52,45.6 75.93,45 48.04,45 47.37,44.33 47.37,24.09 46.71,23.43 U1.37
U1_RX: length 30.3
  Bottom Layer w0.254: U1.27 38,48.83 38.44,49.27 38.44,57.31 38.85,57.72 53.95,57.72 H1.3
U1_TX: length 30.4
  Top Layer w0.254: H1.2 54.1,60.42 38.11,60.42 37.74,60.05 37.74,51.76 37.35,51.37 U1.26
U3_RX: length 46.9
  Top Layer w0.254: U9.9 24.66,31.68 24.92,31.43 U9.9
  Bottom Layer w0.254: U1.16 49.18,53.94 46.54,53.94 45.9,53.3 45.9,48.39 45.12,47.61 31.82,47.61 31.07,46.86 31.07,32 30.49,31.43 U9.9
U3_TX: length 40.6
  Top Layer w0.254: U1.15 47,51.37 46.49,50.87 46.49,45.44 45.96,44.91 32.56,44.91 31.78,44.13 31.78,34.64 31.1,33.97 U9.10
$2N4343: length 20.4
  Top Layer w0.254: LED1.1 85.22,31.3 85.22,33.44 84.81,33.84 R1.2
$2N6086: length 17.9
  Top Layer w0.254: Q1.3 63.08,32.65 63.39,32.95 77.12,32.95 77.68,32.4 BUZZER1.2

## Copper pours and planes (outline as drawn; the poured copper is in the pictures)
GND on Top Layer: -3.55,72.2 100.88,72.2 100.88,-7.67 -3.55,-7.67
GND on Bottom Layer: -4.53,73.75 93.82,73.75 93.82,-3.01 -4.53,-3.01

Small or netless copper shapes (teardrops, artwork), in the pictures only: 27 on Top Layer, 30 on Bottom Layer

## Text on the board
Top Silkscreen Layer: Board B | 板子B | 增加 | 减少 | 切换 | 取消 | 确定
